# Altium schematic sheet ST_LINK_V2-1.SCHDOC: ST-LINK/V2-1
size A4; Date: 9/24/2014; Author: P.A.; CompanyName: STMicroelectronics; Organization: Microcontrollers Division; Address1: 12, Rue Jules HOROWITZ; Address2: 38019 Grenoble; Address3: FRANCE; DocumentNumber: MB1189; Revision: B-07; SheetNumber: 12; SheetTotal: 12; Project: STM32F469I-DISCO
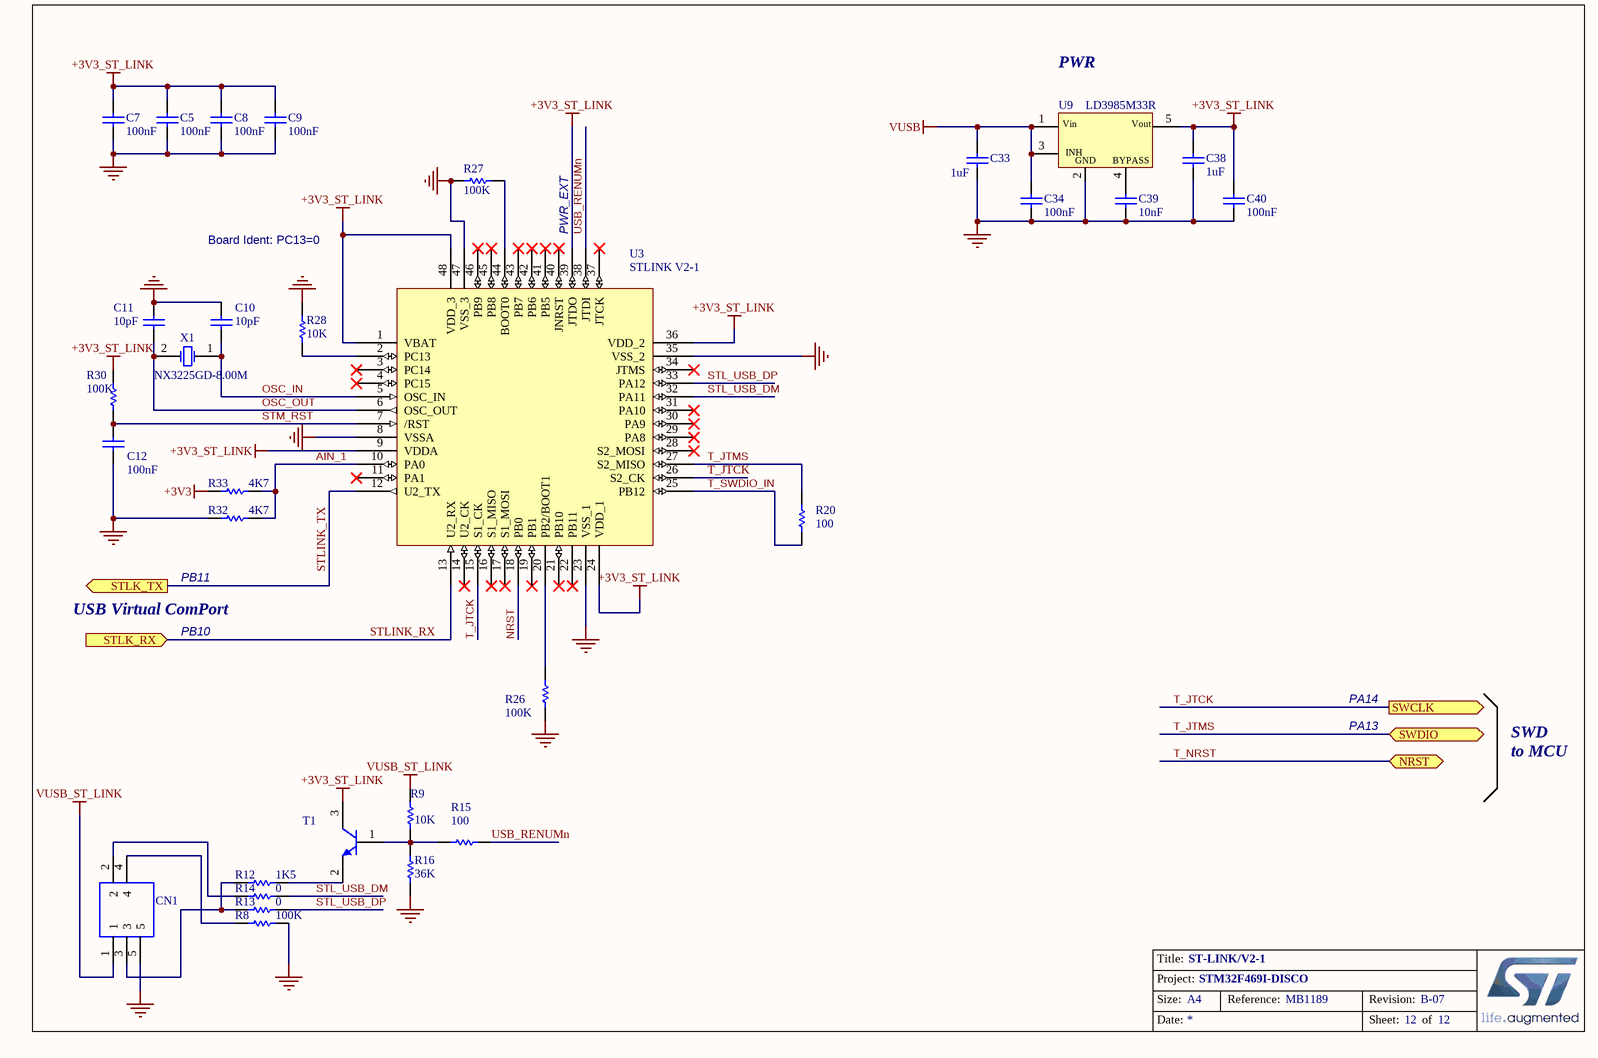
[diagram p0: ST_LINK_V2-1.SCHDOC]

## Parts
C5  100nF  [CAP - 0603]
C7  100nF  [CAP - 0603]
C8  100nF  [CAP - 0603]
C9  100nF  [CAP - 0603]
C10  10pF  [CAP - 0603]
C11  10pF  [CAP - 0603]
C12  100nF  [CAP - 0603]
C33  1uF  [CAP - 0402]
C34  100nF  [CAP - 0402]
C38  1uF  [CAP - 0603]
C39  10nF  [CAP - 0603]
C40  100nF  [CAP - 0603]
CN1  DX4R005HJ5R2000  [DX4R005HJ5]  (value not drawn)
R8  100K  [RES - 0603]
R9  10K  [RES - 0603]
R12  1K5  [RES - 0603]
R13  0  [RES - 0603]
R14  0  [RES - 0603]
R15  100  [RES - 0603]
R16  36K  [RES - 0603]
R20  100  [RES - 0603]
R26  100K  [RES - 0603]
R27  100K  [RES - 0603]
R28  10K  [RES - 0603]
R30  100K  [RES - 0603]
R32  4K7  [RES - 0603]
R33  4K7  [RES - 0603]
T1  9013 replaced by 2STR1160  [SOT23]  (value not drawn)
U3  STLINK V2-1  [QFP50P900X900X160-48N]
U9  LD3985M33R  [SOT95P280X145-5N]
X1  NX3225GD-8.00M  [RESC3226X100N]

## Ports
NRST (bidir), STLK_RX (in), STLK_TX (out), SWCLK (out), SWDIO

## Nets
+3V3: R33.1
+3V3_ST_LINK: C5.2 C7.2 C8.2 C9.2 C38.1 C40.2 R30.2 T1.3(C) U3.1(VBAT) U3.9(VDDA) U3.24(VDD_1) U3.36(VDD_2) U3.39(JTDO) U3.48(VDD_3) U9.5(Vout)
GND: C5.1 C7.1 C8.1 C9.1 C10.2 C11.2 C12.1 C33.1 C34.1 C38.2 C39.1 C40.1 CN1.5 R8.2 R16.1 R26.1 R27.1 R28.1 R32.1 U3.8(VSSA) U3.23(VSS_1) U3.35(VSS_2) U3.47(VSS_3) U9.2(GND)
VUSB: C33.2 C34.2 U9.1(Vin) U9.3(CE)
VUSB_ST_LINK: CN1.1 R9.2
AIN_1: R32.2 R33.2 U3.10(PA0)
NRST: U3.18(PB0)
OSC_IN: C10.1 U3.5(OSC_IN) X1.1(OSC1)
OSC_OUT: C11.1 U3.6(OSC_OUT) X1.2(OSC2)
STL_USB_DM: R14.2 U3.32(PA11)
STL_USB_DP: R13.2 U3.33(PA12)
STLINK_RX: U3.13(U2_RX) ; port STLK_RX
STLINK_TX: U3.12(U2_TX) ; port STLK_TX
STM_RST: C12.2 R30.1 U3.7(/RST)
T_JTCK: U3.15(S1_CK) U3.26(S2_CK) ; port SWCLK
T_JTMS: R20.2 U3.27(S2_MISO) ; port SWDIO
T_NRST: port NRST
T_SWDIO_IN: R20.1 U3.25(PB12)
USB_RENUMn: R15.2 U3.38(JTDI)
NetC39_2: C39.2 U9.4(BYPASS)
NetCN1_2: CN1.2 R14.1
NetCN1_3: CN1.3 R12.1 R13.1
NetCN1_4: CN1.4 R8.1
NetR9_1: R9.1 R15.1 R16.2 T1.1(B)
NetR12_2: R12.2 T1.2(E)
NetR26_2: R26.2 U3.20(PB2/BOOT1)
NetR27_2: R27.2 U3.44(BOOT0)
NetR28_2: R28.2 U3.2(PC13)

Not connected (* = marked no-connect by the designer): U3 3(PC14)* 4(PC15)* 11(PA1)* 14(U2_CK)* 16(S1_MISO)* 17(S1_MOSI)* 19(PB1)* 21(PB10)* 22(PB11)* 28(S2_MOSI)* 29(PA8)* 30(PA9)* 31(PA10)* 34(JTMS)* 37(JTCK)* 40(JNRST)* 41(PB5)* 42(PB6)* 43(PB7)* 45(PB8)* 46(PB9)*

## Notes on the sheet
- PWR
- Board Ident: PC13=0
- PWR_EXT
- PB11
- USB Virtual ComPort
- PB10
- PA14
- PA13
- SWD
  to MCU
- Title:
- Project:
- Size:
- Date:
- A4
- Reference:
- Sheet:
- Revision:
- of
- (in symbol LD3985M33R) INH

## Library data of the parts
C5 C7-C9 C12 C34 C40 = Capacitor_ST: Capacitor 0402 / 0603 / 0805; Ordered by: Subcon; Revision: July-2002: Re-released for DXP Platform.; Value: 100nF
C10 C11 = Capacitor_ST: Capacitor 0402 / 0603 / 0805; Value: 100nF; Ordered by: Subcon; Revision: July-2002: Re-released for DXP Platform.
C33 C38 = CAP SMD 0603  X5R 1µF 25V 10%: Capacitor; Value: 1µF; Rated voltage: 25V; Tolerance: 10%; Ordered by: Subcon; Manufacturer: *; Manufacturer P/N: *; Order code Farnell: 1288202RL; Power: *; Technology: X5R; Temperature  Factor: *; Temperature Max: +125°C; Temperature Min: -55°C; STS Code: *
C39 = CAP SMD 0603  X7R 10000PF 50V 10%: 0603  X7R 10NF; Order code RS: 2040779; Rated voltage: 50V; Tolerance: 10%; Ordered by: Subcon; Order code Farnell: 7569548RL; Value: 10NF; Power: *; Technology: X7R; Temperature Factor: *; Temperature Min: -55°C; Temperature Max: +125°C; STS Code: *
CN1 = DX4R005HJ5R2000: USB Connectors microUSB 2.0 TYPE B STDMNT RCPT NO TAPER; Manufacturer_Name: JAE Electronics; Allied_Number: 70627266; Manufacturer_Part_Number: DX4R005HJ5R2000; RS Part Number: *; RS Price/Stock: *; Allied Price/Stock: http://www.alliedelec.com/jae-electronics-inc-dx4r005hj5r2000/70627266/; Datasheet Link: https://www.jae.com/z-en/pdf_download_exec.cfm?param=SJ111770.pdf
R8 = res1: Resistor; Value: 1K; Ordered by: Subcon; Published: 8-Jun-2000; Revision: July-2002: Re-released for DXP Platform.; Publisher: Altium Limited
R9 R16 = Res1: Resistor; Value: 1K; Ordered by: Subcon; Published: 8-Jun-2000; Revision: July-2002: Re-released for DXP Platform.; Publisher: Altium Limited
R12-R14 R20 = Resistor_ST: Resistor; Value: 10K; Ordered by: Subcon
R15 R26 R27 R30 R32 R33 = Resistor_ST: Resistor 0402 / 0603 / 0805; Value: 10K; Ordered by: Subcon
R28 = Resistor_ST: Resistor; Ordered by: Subcon; Value: 10K
T1 = NPN: NPN Bipolar Transistor; Manuf_Part_1: MMBT9013; Code - JEDEC: TO-226-AA; Ordered by: Subcon; ECCN_US/EU: EAR99/NEC; Published: 8-Jun-2000; Revision: July-2002: Re-released for DXP Platform.; Publisher: Altium Limited
U3 = STM32F10x(48pin): Manuf_Part_1: STM32F103CBT6; Ordered by: ST; ECCN_US/EU: 3A991A2/NEC; Ref St: 9175111; Distrib: ST; Manuf_1: ST
U9 = LD3985M33R: Ultra low drop-low noise BiCMOS voltage, regulators low ESR capacitors compatible; Manuf_1: ST; Ref St: 9176161; ECCN_US/EU: EAR99/NEC; Manuf_Part_1: LD3985M33R; Provided: ST; Distrib: ST; Order: LD3985M33R; Ordered by: ST
X1 = XTAL_8M_NX3225GD: Crystal 8Mhz, 8pF, -+50PPM, SMD; Manuf_1: NDK; Manuf_Part_1: NX3225GD 8MHz EXS00A-CG04874; Manuf_Part_2: NX3225GD-8.000M-STD-CRA-3; ECCN_US/EU: EAR99/NEC; NDK Ref: X3127326; Ref St: 9157029; Provided: ST; Order: NX3225GD 8MHz EXS00A-CG04874; Ordered by: ST